# Altium project SDC.PrjPcb
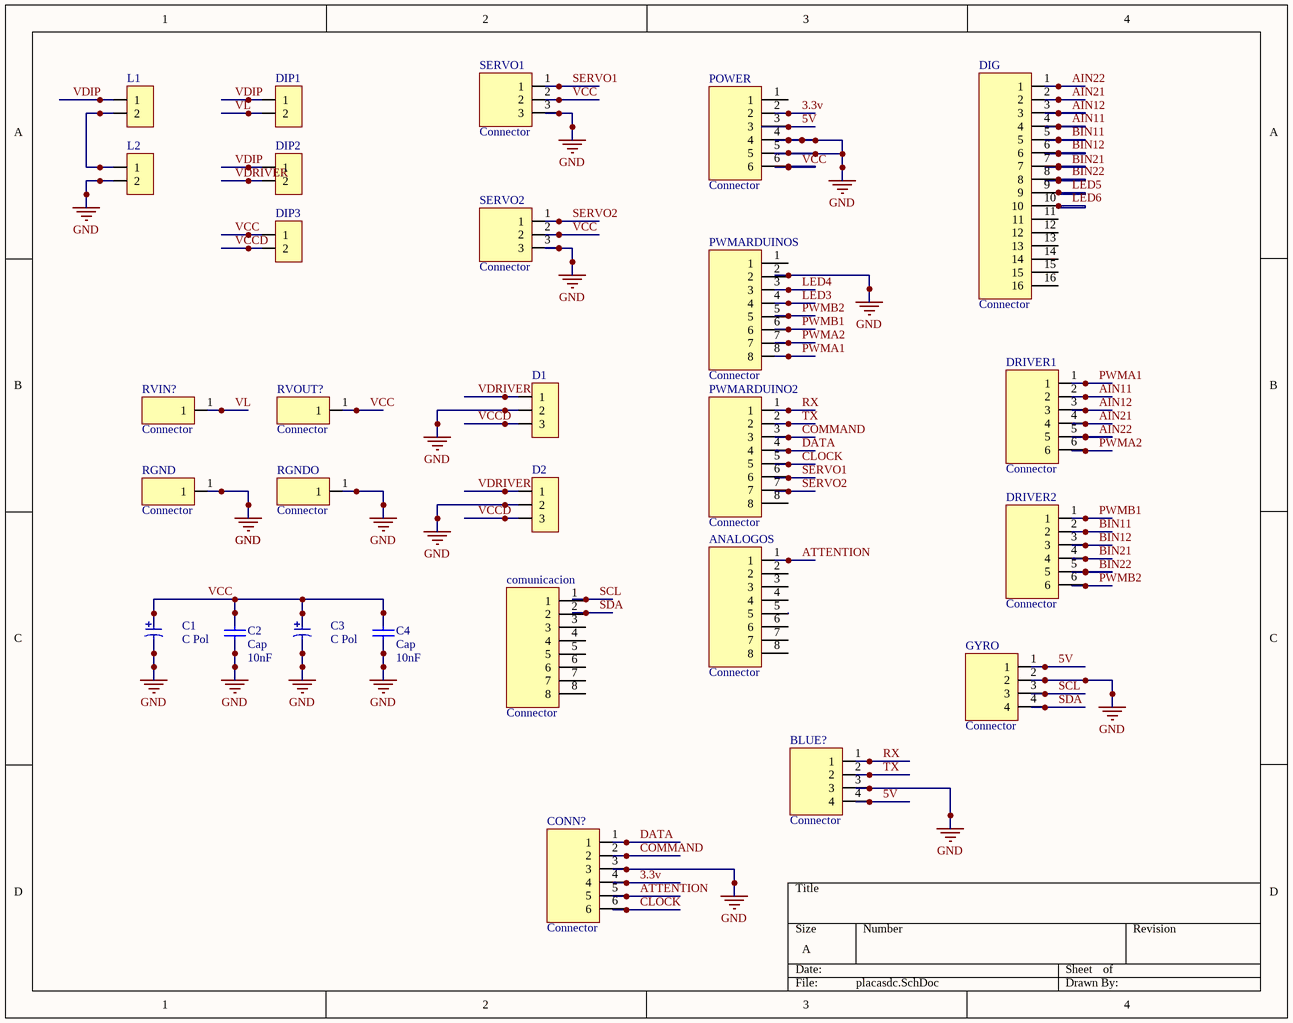
[diagram p0: placasdc.SchDoc]
1 sheet, 28 parts. Net scope: global (net labels, ports and power ports of the same name join across sheets).
Board file: PCBSDC.PcbDoc

## Sheet placasdc.SchDoc
size A

### Parts
ANALOGOS  Connector  [1x8x2.54 Pin Header TH V]
BLUE?  Connector  [1x4x2.54 Pin Header TH V]
C1  C Pol  [C Elec SMD 4x5.4-10u-16V]
C2  Cap  value 10nF  [C0603-0.80]
C3  C Pol  [C Elec SMD 4x5.4-10u-16V]
C4  Cap  value 10nF  [C0603-0.80]
comunicacion  Connector  [1x8x2.54 Pin Header TH V]
CONN?  Connector  [1x6x2.54 Pin Header TH V]
D1  WE-Terminal Blocks Plugable Type 691311700003  [691311700003]  (value not drawn)
D2  WE-Terminal Blocks Plugable Type 691311700003  [691311700003]  (value not drawn)
DIG  Connector  [1x16x2.54 Pin Header TH V]
DIP1  WE-Terminal Blocks Plugable Type 691311700002  [691311700002]  (value not drawn)
DIP2  WE-Terminal Blocks Plugable Type 691311700002  [691311700002]  (value not drawn)
DIP3  WE-Terminal Blocks Plugable Type 691311700002  [691311700002]  (value not drawn)
DRIVER1  Connector  [1x6x2.54 Pin Header TH V]
DRIVER2  Connector  [1x6x2.54 Pin Header TH V]
GYRO  Connector  [1x4x2.54 Pin Header TH V]
L1  WE-Terminal Blocks Plugable Type 691311700002  [691311700002]  (value not drawn)
L2  WE-Terminal Blocks Plugable Type 691311700002  [691311700002]  (value not drawn)
POWER  Connector  [1x6x2.54 Pin Header TH V]
PWMARDUINO2  Connector  [1x8x2.54 Pin Header TH V]
PWMARDUINOS  Connector  [1x8x2.54 Pin Header TH V]
RGND  Connector  [1x1x2.54 Pin Header TH V]
RGNDO  Connector  [1x1x2.54 Pin Header TH V]
RVIN?  Connector  [1x1x2.54 Pin Header TH V]
RVOUT?  Connector  [1x1x2.54 Pin Header TH V]
SERVO1  Connector  [1x3x2.54 Pin Header TH V]
SERVO2  Connector  [1x3x2.54 Pin Header TH V]

### Nets
GND: BLUE?.3 C1.1 C2.1 C3.1 C4.1 CONN?.3 D1.2 D2.2 GYRO.2 L2.2 POWER.4 POWER.5 PWMARDUINOS.2 RGND.1 RGNDO.1 SERVO1.3 SERVO2.3
3.3v: CONN?.4 POWER.2
5V: BLUE?.4 GYRO.1 POWER.3
AIN11: DIG.4 DRIVER1.2
AIN12: DIG.3 DRIVER1.3
AIN21: DIG.2 DRIVER1.4
AIN22: DIG.1 DRIVER1.5
ATTENTION: ANALOGOS.1 CONN?.5
BIN11: DIG.5 DRIVER2.2
BIN12: DIG.6 DRIVER2.3
BIN21: DIG.7 DRIVER2.4
BIN22: DIG.8 DRIVER2.5
CLOCK: CONN?.6 PWMARDUINO2.5
COMMAND: CONN?.2 PWMARDUINO2.3
DATA: CONN?.1 PWMARDUINO2.4
LED3: PWMARDUINOS.4
LED4: PWMARDUINOS.3
LED5: DIG.9
LED6: DIG.10
PWMA1: DRIVER1.1 PWMARDUINOS.8
PWMA2: DRIVER1.6 PWMARDUINOS.7
PWMB1: DRIVER2.1 PWMARDUINOS.6
PWMB2: DRIVER2.6 PWMARDUINOS.5
RX: BLUE?.1 PWMARDUINO2.1
SCL: comunicacion.1 GYRO.3
SDA: comunicacion.2 GYRO.4
SERVO1: PWMARDUINO2.6 SERVO1.1
SERVO2: PWMARDUINO2.7 SERVO2.1
TX: BLUE?.2 PWMARDUINO2.2
VCC: C1.2 C2.2 C3.2 C4.2 DIP3.1 POWER.6 RVOUT?.1 SERVO1.2 SERVO2.2
VCCD: D1.3 D2.3 DIP3.2
VDIP: DIP1.1 DIP2.1 L1.1
VDRIVER: D1.1 D2.1 DIP2.2
VL: DIP1.2 RVIN?.1
NetL1_2: L1.2 L2.1

Not connected (* = marked no-connect by the designer): ANALOGOS 2 3 4 5 6 7 8; comunicacion 3 4 5 6 7 8; DIG 11 12 13 14 15 16; POWER 1; PWMARDUINO2 8; PWMARDUINOS 1

### Library data of the parts
ANALOGOS comunicacion PWMARDUINO2 PWMARDUINOS = Header 1x8
BLUE? GYRO = Header 1x4
C1 C3 = C Pol: Capacitor, polarized, generic
C2 C4 = Cap: Capacitor; Published: 8-Jun-2000; LatestRevisionDate: 17-Jul-2002; LatestRevisionNote: Re-released for DXP Platform.; PackageReference: RAD-0.3; Publisher: Altium Limited; PackageDescription: Radial Cap, Thru-Hole; 2 Leads; 0.3 in Pin Spacing
CONN? DRIVER1 DRIVER2 POWER = Header 1x6
D1 D2 = WE-Terminal Blocks Plugable Type 691311700003: WR-TBL Terminal block - serie 3117 - 5.00mm; Manufacturer: W¨¹rth Elektronik eiSos GmbH; ComponentLink1 Description: Manufacturer; ComponentLink2 Description: Datasheet; NoPins: 03; Created Date: 6 January 2014; partNo: 691311700003; ComponentLink1URL: http://www.we-online.com; ComponentLink2URL: http://katalog.we-online.de/em/datasheet/6913117000xx.pdf; Created by: Karrer Zheng
DIG = Header 1x16
DIP1-DIP3 L1 L2 = WE-Terminal Blocks Plugable Type 691311700002: WR-TBL Terminal block - serie 3117 - 5.00mm; Manufacturer: W¨¹rth Elektronik eiSos GmbH; ComponentLink1 Description: Manufacturer; ComponentLink2 Description: Datasheet; NoPins: 02; Created Date: 6 January 2014; partNo: 691311700002; ComponentLink1URL: http://www.we-online.com; ComponentLink2URL: http://katalog.we-online.de/em/datasheet/6913117000xx.pdf; Created by: Karrer Zheng
RGND RGNDO RVIN? RVOUT? = Header 1x1
SERVO1 SERVO2 = Header 1x3